# Altium schematic sheet Processor.SchDoc
size A3; Organization: Altium Limited; Address1: L3, 12a Rodborough Rd; Address2: Frenchs Forest; Address3: NSW; Address4: Australia 2086; DocumentNumber: 5; SheetNumber: 5; SheetTotal: 8
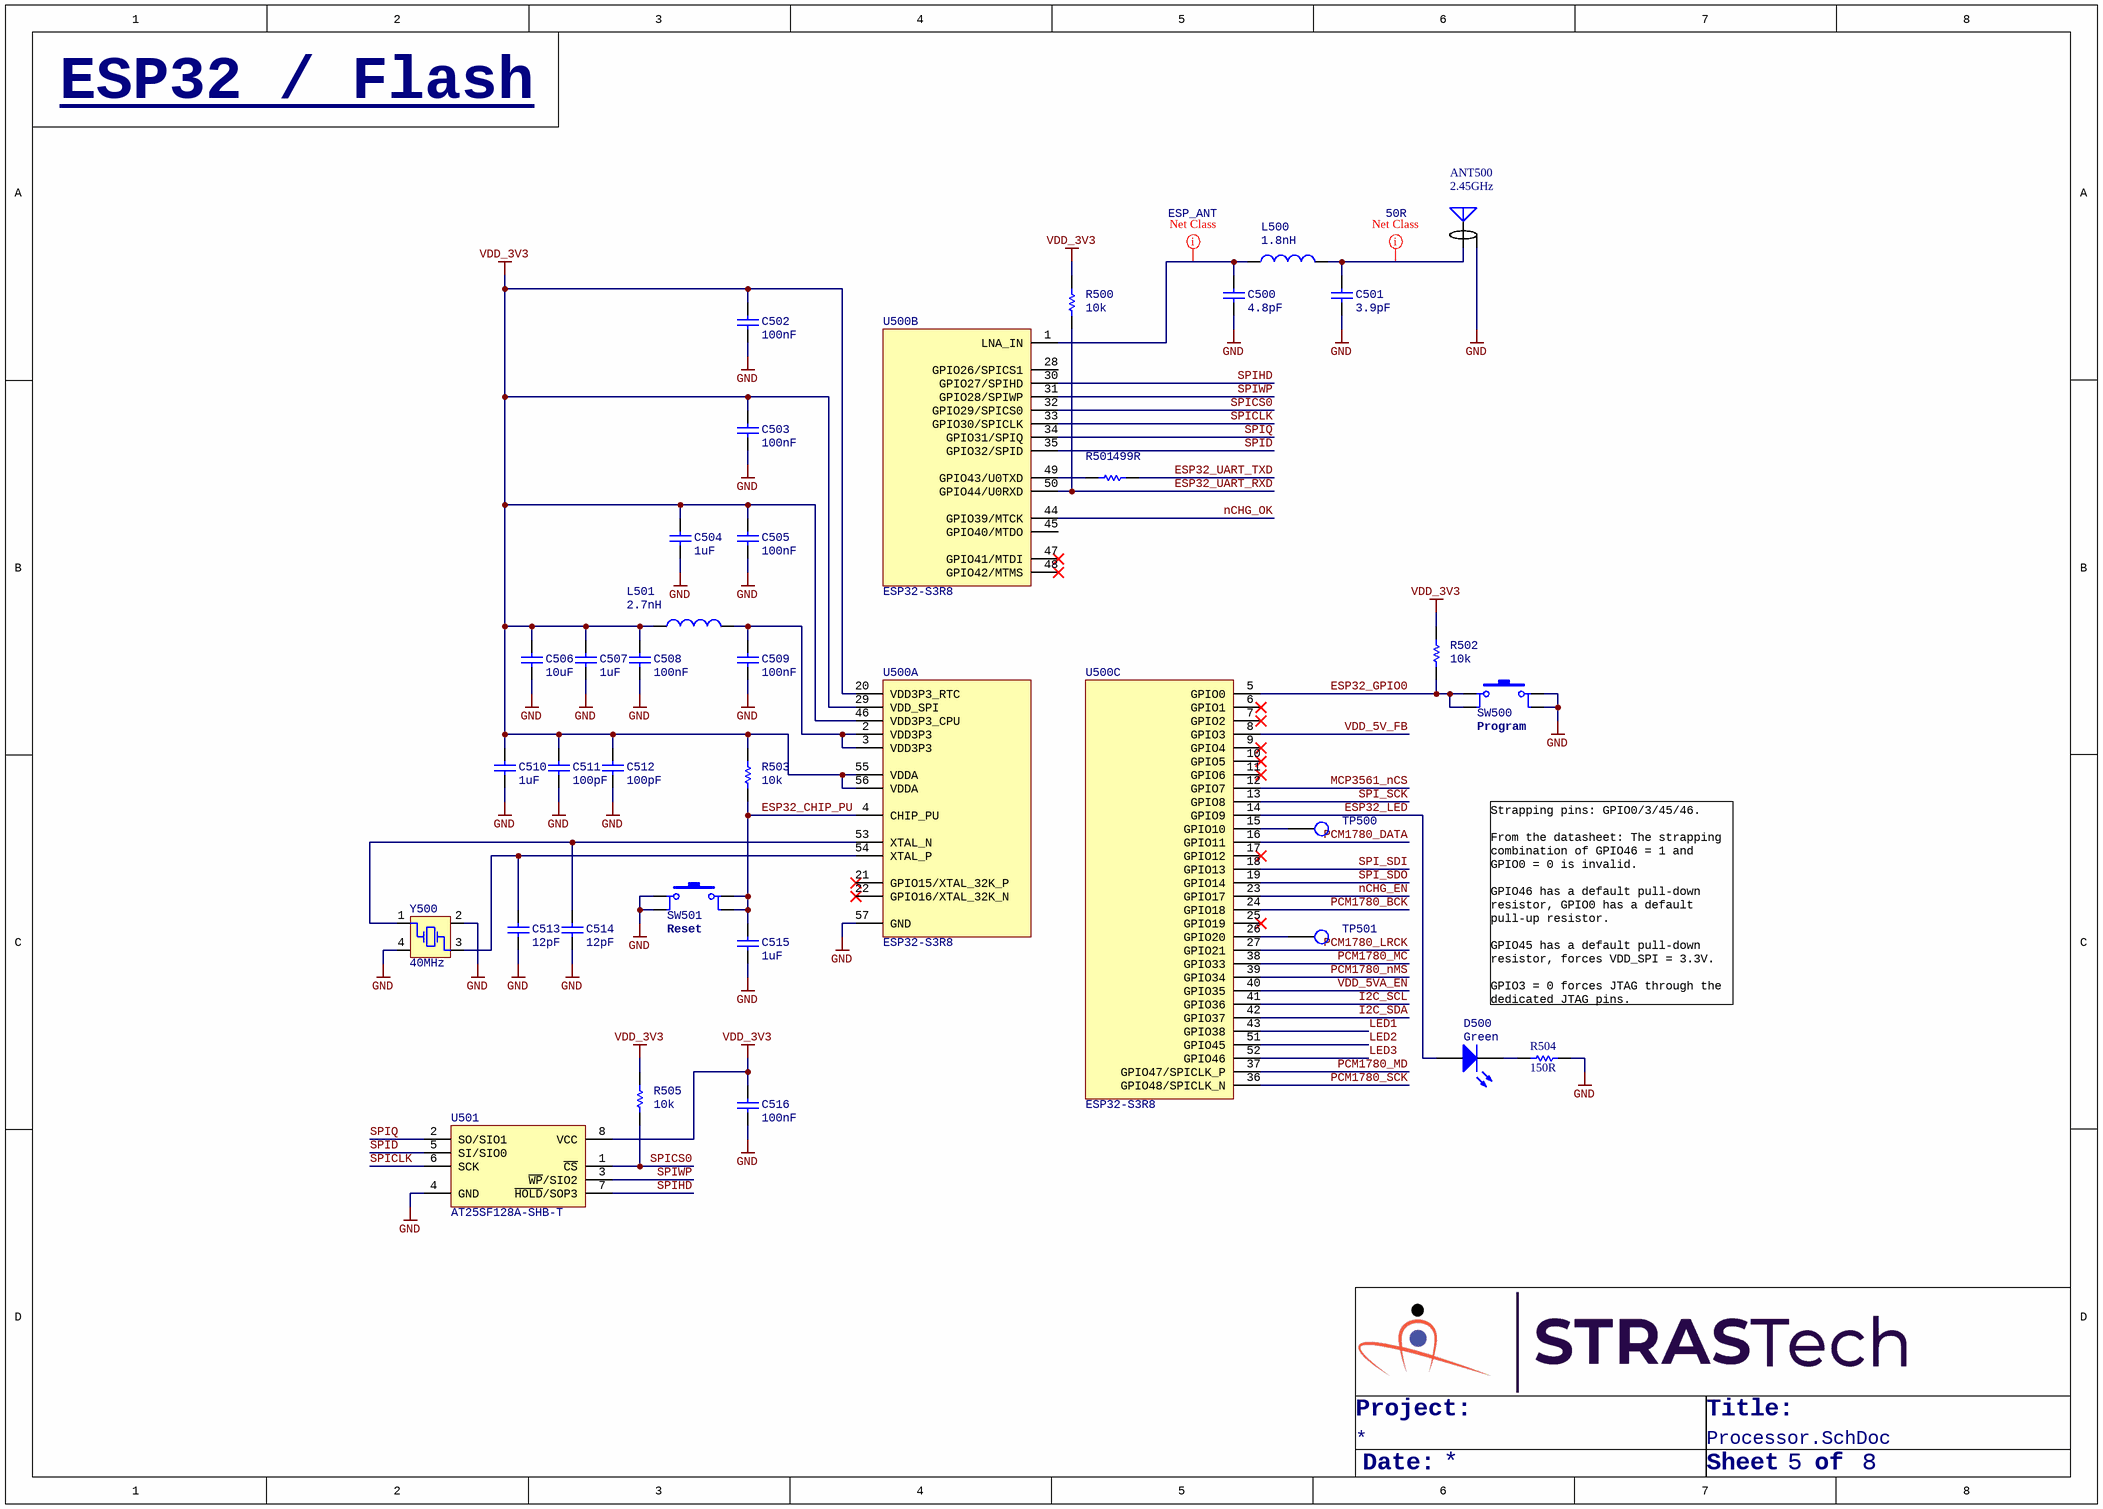
[diagram p0: Processor.SchDoc]

## Parts
ANT500  2.45GHz  [ANT,PCB,IFA,2.45GHZ]
C500  4.8pF  [Cap,SMD,0402]
C501  3.9pF  [Cap,SMD,0402]
C502  100nF  [Cap,SMD,0402]
C503  100nF  [Cap,SMD,0402]
C504  1uF  [Cap,SMD,0402]
C505  100nF  [Cap,SMD,0402]
C506  10uF  [Cap,SMD,0402]
C507  1uF  [Cap,SMD,0402]
C508  100nF  [Cap,SMD,0402]
C509  100nF  [Cap,SMD,0402]
C510  1uF  [Cap,SMD,0402]
C511  100pF  [Cap,SMD,0402]
C512  100pF  [Cap,SMD,0402]
C513  12pF  [Cap,SMD,0402]
C514  12pF  [Cap,SMD,0402]
C515  1uF  [Cap,SMD,0402]
C516  100nF  [Cap,SMD,0402]
D500  Green  [LED,0603]
L500  1.8nH  [ind,0402]
L501  2.7nH  [ind,0402]
R500  10k  [RES,0402]
R501  499R  [RES,0402]
R502  10k  [RES,0402]
R503  10k  [RES,0402]
R504  150R  [RES,0402]
R505  10k  [RES,0402]
SW500  Switch  [Switch,Tactile,Micro,SPST-NO,SMD]  (value not drawn)
SW501  Switch  [Switch,Tactile,Micro,SPST-NO,SMD]  (value not drawn)
TP500  TESTPOINT  [testpoint,smd,round,1mm]  (value not drawn)
TP501  TESTPOINT  [testpoint,smd,round,1mm]  (value not drawn)
U500  ESP32-S3R8  [IC,QFN-56,7X7,P0.4MM]  (parts A,B,C of 3)
U501  AT25SF128A-SHB-T  [IC,SOIC-8,1.27mm,W5.28]
Y500  40MHz  [XTAL,SMD,4 Pin,2x2.5mm]

## Nets
GND: ANT500.2 C500.1 C501.1 C502.1 C503.1 C504.1 C505.1 C506.1 C507.1 C508.1 C509.1 C510.1 C511.1 C512.1 C513.2 C514.2 C515.1 C516.1 R504.2 SW500.3 SW500.4 SW501.1 SW501.2 U500.57(GND) U501.4(GND) Y500.2(GND) Y500.4(GND)
VDD_3V3: C502.2 C503.2 C504.2 C505.2 C506.2 C507.2 C508.2 C510.2 C511.2 C512.2 C516.2 L501.1 R500.2 R502.1 R503.1 R505.2 U500.20(VDD3P3_RTC) U500.29(VDD_SPI) U500.46(VDD3P3_CPU) U500.55(VDDA) U500.56(VDDA) U501.8(VCC)
ESP32_CHIP_PU: C515.2 R503.2 SW501.3 SW501.4 U500.4(CHIP_PU)
ESP32_GPIO0: R502.2 SW500.1 SW500.2 U500.5(GPIO0)
ESP32_LED: D500.1(A) U500.14(GPIO9)
ESP32_UART_RXD: R500.1 U500.50(GPIO44/U0RXD)
ESP32_UART_TXD: R501.2
I2C_SCL: U500.41(GPIO36)
I2C_SDA: U500.42(GPIO37)
LED1: U500.43(GPIO38)
LED2: U500.51(GPIO45)
LED3: U500.52(GPIO46)
MCP3561_nCS: U500.12(GPIO7)
nCHG_EN: U500.23(GPIO17)
nCHG_OK: U500.44(GPIO39/MTCK)
PCM1780_BCK: U500.24(GPIO18)
PCM1780_DATA: U500.16(GPIO11)
PCM1780_LRCK: U500.27(GPIO21)
PCM1780_MC: U500.38(GPIO33)
PCM1780_MD: U500.37(GPIO47/SPICLK_P)
PCM1780_nMS: U500.39(GPIO34)
PCM1780_SCK: U500.36(GPIO48/SPICLK_N)
SPI_SCK: U500.13(GPIO8)
SPI_SDI: U500.18(GPIO13)
SPI_SDO: U500.19(GPIO14)
SPICLK: U500.33(GPIO30/SPICLK) U501.6(SCK)
SPICS0: R505.1 U500.32(GPIO29/SPICS0) U501.1(~{CS})
SPID: U500.35(GPIO32/SPID) U501.5(SI/SIO0)
SPIHD: U500.30(GPIO27/SPIHD) U501.7(~{HOLD}/SOP3)
SPIQ: U500.34(GPIO31/SPIQ) U501.2(SO/SIO1)
SPIWP: U500.31(GPIO28/SPIWP) U501.3(~{WP}/SIO2)
VDD_5V_FB: U500.8(GPIO3)
VDD_5VA_EN: U500.40(GPIO35)
NetANT500_1: ANT500.1 C501.2 L500.2
NetC500_2: C500.2 L500.1 U500.1(LNA_IN)
NetC509_2: C509.2 L501.2 U500.2(VDD3P3) U500.3(VDD3P3)
NetC513_1: C513.1 U500.54(XTAL_P) Y500.3(OSC2)
NetC514_1: C514.1 U500.53(XTAL_N) Y500.1(OSC1)
NetD500_2: D500.2(K) R504.1
NetR501_1: R501.1 U500.49(GPIO43/U0TXD)
NetTP500_1: TP500.1(TP) U500.15(GPIO10)
NetTP501_1: TP501.1(TP) U500.26(GPIO20)

Not connected (* = marked no-connect by the designer): U500 6(GPIO1)* 7(GPIO2)* 9(GPIO4)* 10(GPIO5)* 11(GPIO6)* 17(GPIO12)* 21(GPIO15/XTAL_32K_P)* 22(GPIO16/XTAL_32K_N)* 25(GPIO19)* 28(GPIO26/SPICS1) 45(GPIO40/MTDO) 47(GPIO41/MTDI)* 48(GPIO42/MTMS)*

## Layout directives
net class ESP_ANT: NetC500_2
net class 50R: NetANT500_1

## Notes on the sheet
- ESP32 / Flash
- (near SW500) Program
- (near SW501) Reset
- Strapping pins: GPIO0/3/45/46.
  From the datasheet: The strapping combination of GPIO46 = 1 and GPIO0 = 0 is invalid.
  GPIO46 has a default pull-down resistor, GPIO0 has a default pull-up resistor.
  GPIO45 has a default pull-down resistor, forces VDD_SPI = 3.3V.
  GPIO3 = 0 forces JTAG through the dedicated JTAG pins.
- Project:
- Title:
- Date:
- Sheet
- of
- Title
- Size:
- A3
- Revision:
- Design By:

## Library data of the parts
ANT500 = ANT,2.45GHz,IFA,PCB: 2.4-GHz Inverted F Antenna; HelpURL: https://www.ti.com/lit/an/swru120d/swru120d.pdf?ts=1646240772720&ref_url=https%253A%252F%252Fwww.google.com%252F; CreatedBy: Judd Foster; Manufacturer: N/A; Manufacturer Part Number: N/A; Vendor: N/A; Vendor Part Number: N/A
C500 = CAP,Cer,4.8pF,50VDC,C0G/NP0,0402: 4.8 pF ±0.25pF 50V Ceramic Capacitor C0G, NP0 0402 (1005 Metric); Vendor Part Number: 490-17481-1-ND; Manufacturer: Murata Electronics; Manufacturer Part Number: GCQ1555C1H4R8CB01D; Vendor: Digikey; HelpURL: https://search.murata.co.jp/Ceramy/image/img/A01X/G101/ENG/GCQ1555C1H4R8CB01-01.pdf; CreatedBy: Judd Foster
C501 = CAP,Cer,3.9pF,50VDC,C0G/NP0,0402: 3.9 pF ±0.1pF 50V Ceramic Capacitor C0G, NP0 0402 (1005 Metric); Vendor Part Number: 399-CBR04C399B5GACCT-ND; Manufacturer: KEMET; Manufacturer Part Number: CBR04C399B5GAC; Vendor: Digikey; HelpURL: https://api.kemet.com/component-edge/download/datasheet/CBR04C399B5GAC.pdf; CreatedBy: Judd Foster
C502 C503 C505 C508 C509 C516 = CAP,Cer,100nF,25VDC,X7R,0402: 0.1µF ±10% 25V Ceramic Capacitor X7R 0402 (1005 Metric); Vendor Part Number: 490-14603-1-ND; Manufacturer: Murata Electronics; Manufacturer Part Number: GRM155R71E104KE14J; Vendor: Digikey; HelpURL: https://search.murata.co.jp/Ceramy/image/img/A01X/G101/ENG/GRM155R71E104KE14-01.pdf; CreatedBy: Judd Foster
C504 C507 C510 = CAP,Cer,1uF,35VDC,X5R,0402: 1 µF ±10% 35V Ceramic Capacitor X5R 0402 (1005 Metric); Vendor Part Number: 445-9073-1-ND; Manufacturer: TDK Corporation; Manufacturer Part Number: C1005X5R1V105K050BC; Vendor: Digikey; HelpURL: https://product.tdk.com/info/en/catalog/datasheets/mlcc_commercial_general_en.pdf?ref_disty=digikey; CreatedBy: Judd Foster
C506 = CAP,Cer,10uF,10VDC,X5R,0402: 10 µF ±20% 10V Ceramic Capacitor X5R 0402 (1005 Metric); Vendor Part Number: 1276-1450-1-ND; Manufacturer: Samsung Electro-Mechanics; Manufacturer Part Number: CL05A106MP5NUNC; Vendor: Digikey; HelpURL: https://media.digikey.com/pdf/Data%20Sheets/Samsung%20PDFs/CL05A106MP5NUNC_Spec.pdf; CreatedBy: Judd Foster
C511 C512 = CAP,Cer,100pF,50VDC,C0G/NP0,0402: 100pF ±5% 50V Ceramic Capacitor C0G, NP0 0402 (1005 Metric); Vendor Part Number: 490-10669-1-ND; Manufacturer: Murata Electronics; Manufacturer Part Number: GCM1555C1H101JA16D; Vendor: Digikey; HelpURL: https://www.murata.com/~/media/webrenewal/support/library/catalog/products/capacitor/mlcc/c03e.ashx?la=en-us; CreatedBy: Judd Foster
C513 C514 = CAP,Cer,12pF,50VDC,C0G/NP0,0402: 12pF ±5% 50V Ceramic Capacitor C0G, NP0 0402 (1005 Metric); Vendor Part Number: 311-1016-1-ND; Manufacturer: Yageo; Manufacturer Part Number: CC0402JRNPO9BN120; Vendor: Digikey; HelpURL: https://www.yageo.com/upload/media/product/productsearch/datasheet/mlcc/UPY-GP_NP0_16V-to-50V_18.pdf; CreatedBy: Judd Foster
C515 = CAP,Cer,1uF,6.3VDC,X5R,0402: 1µF ±20% 6.3V Ceramic Capacitor X5R 0402 (1005 Metric); Vendor Part Number: 1276-1235-1-ND; Manufacturer: Samsung Electro-Mechanics; Manufacturer Part Number: CL05A105MQ5NNNC; Vendor: Digikey; HelpURL: https://media.digikey.com/pdf/Data%20Sheets/Samsung%20PDFs/CL_Series_MLCC_ds.pdf; CreatedBy: Judd Foster
D500 = LED,Green,SMD,0603: Green 530nm LED Indication - Discrete 3V 0603 (1608 Metric); Manufacturer: Stanley Electric Co; Manufacturer Part Number: THG1111C-0005-TR; Vendor Part Number: 404-1286-1-ND; Vendor: Digikey; CreatedBy: Judd Foster; HelpURL: http://www.stanley-components.com/php/downloaddatafile.php?rp=0,THG1111C-0005_e.pdf
L500 = IND,1.8nH,900mA,Multilayer,0402: 1.8 nH Unshielded Multilayer Inductor 900 mA 100mOhm Max 0402 (1005 Metric); Vendor Part Number: 490-1076-1-ND; Manufacturer: Murata Electronics; Manufacturer Part Number: LQG15HN1N8S02D; Vendor: Digikey; HelpURL: https://search.murata.co.jp/Ceramy/image/img/P02/JELF243B-0009.pdf; CreatedBy: Judd Foster
L501 = IND,2.7nH,800mA,Multilayer,0402: 2.7nH Unshielded Multilayer Inductor 800mA 150mOhm Max 0402 (1005 Metric); Vendor Part Number: 490-2615-1-ND; Manufacturer: Murata Electronics; Manufacturer Part Number: LQG15HS2N7S02D; Vendor: Digikey; HelpURL: https://psearch.en.murata.com/inductor/product/LQG15HS2N7S02_.pdf; CreatedBy: Judd Foster
R500 R502 R503 R505 = RES,10k,5%,0.063W,0402: 10 kOhms ±5% 0.063W, 1/16W Chip Resistor 0402 (1005 Metric) Automotive AEC-Q200 Thick Film; Vendor Part Number: RMCF0402JT10K0CT-ND; Manufacturer: Stackpole Electronics Inc; Manufacturer Part Number: RMCF0402JT10K0; Vendor: DIgikey; HelpURL: https://www.seielect.com/catalog/sei-rmcf_rmcp.pdf; CreatedBy: Judd Foster
R501 = RES,499R,1%,0.063W,0402: 499 Ohms ±1% 0.063W, 1/16W Chip Resistor 0402 (1005 Metric) Automotive AEC-Q200 Thick Film; Manufacturer: Stackpole Electronics Inc; Manufacturer Part Number: RMCF0402FT499R; Vendor Part Number: RMCF0402FT499RCT-ND; Vendor: Digikey; CreatedBy: Judd Foster; HelpURL: https://www.seielect.com/catalog/sei-rmcf_rmcp.pdf
R504 = RES,150R,1%,0.1W,0402: 150 Ohms ±1% 0.063W, 1/16W Chip Resistor 0402 (1005 Metric) Automotive AEC-Q200, Moisture Resistant Thick Film; Manufacturer: TE Connectivity Passive Product; Manufacturer Part Number: CRGCQ0402F150R; Vendor Part Number: A129617CT-ND; Vendor: Digikey; CreatedBy: Judd Foster; HelpURL: https://www.te.com/commerce/DocumentDelivery/DDEController?Action=srchrtrv&DocNm=1773204-3&DocType=DS&DocLang=English
SW500 SW501 = Switch,Tactile,SPST-NO,SMD,H1.5: Tactile Switch SPST-NO Top Actuated Surface Mount; Manufacturer: C&K; Manufacturer Part Number: PTS525SM15SMTR2 LFS; Vendor Part Number: CKN9104CT-ND; Vendor: Digikey; CreatedBy: Judd Foster; HelpURL: https://www.ckswitches.com/media/1467/pts525.pdf
TP500 TP501 = TESTPOINT: PCB Testpoint; CreatedBy: Judd Foster; HelpURL: N/A; Manufacturer: N/A; Manufacturer Part Number: N/A; Vendor: N/A; Vendor Part Number: N/A
U500 = ESP32-S3R8: IC RF TxRx + MCU Bluetooth, WiFi 802.11b/g/n, Bluetooth v5.0 2.412GHz ~ 2.484GHz 56-VFQFN Exposed Pad; Manufacturer: Espressif Systems; Vendor Part Number: 1904-ESP32-S3R8-ND; Vendor: Digikey; CreatedBy: Judd Foster; HelpURL: https://www.espressif.com/sites/default/files/documentation/esp32-s3_datasheet_en.pdf; Manufacturer Part Number: ESP32-S3R8
U501 = AT25SF128A-SHB-T: FLASH - NOR Memory IC 128Mb (16M x 8) SPI - Quad I/O 133 MHz 8-SOIC; Manufacturer: Adesto Technologies; Vendor Part Number: 1265-1348-1-ND; Vendor: Digikey; CreatedBy: Judd Foster; HelpURL: https://www.dialog-semiconductor.com/sites/default/files/2021-02/DS-AT25SF128A-168.pdf; Manufacturer Part Number: AT25SF128A-SHB-T
Y500 = XTAL,40MHz,12pF,SMD: 40 MHz ±7ppm Crystal 12pF 25 Ohms 4-SMD, No Lead; Manufacturer: Hosonic Electronic Co., Ltd; Manufacturer Part Number: E2SB40E000104E; Vendor Part Number: 3186-E2SB40E000104ECT-ND; Vendor: Digikey; CreatedBy: Judd Foster; HelpURL: https://ecsxtal.com/store/pdf/ECS-33B.pdf